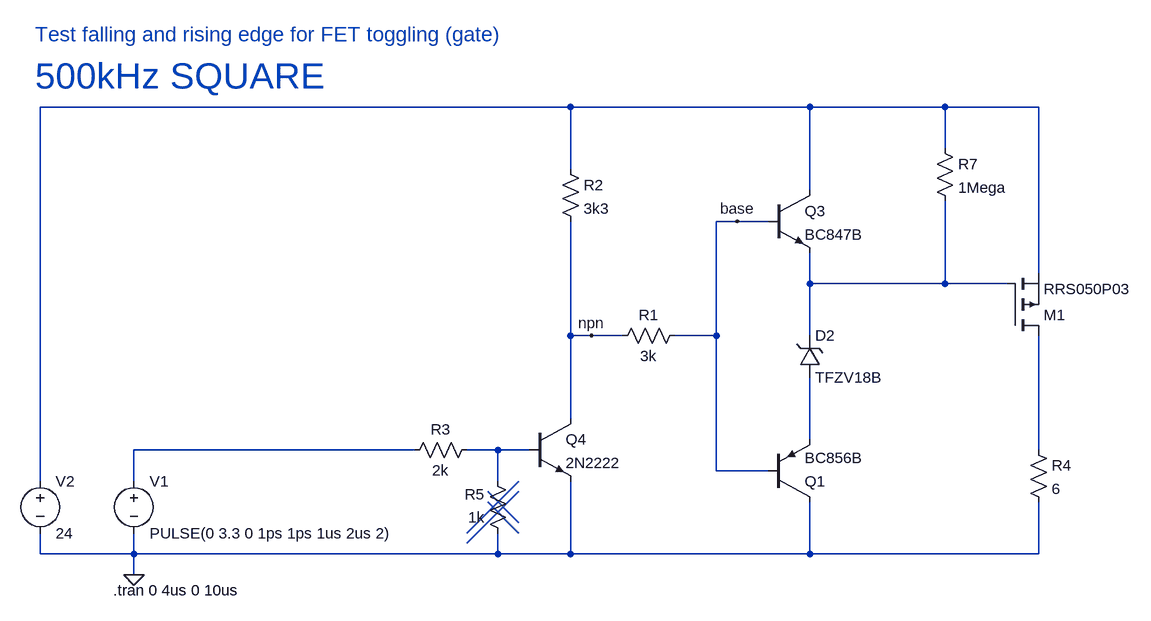
[diagram p0: schematic pwm-soldering-500kHz(original).asc]
pwm-soldering-500kHz(original).asc, the LTspice schematic file:
Version 4
SHEET 1 1716 680
WIRE 736 -576 -80 -576
WIRE 1104 -576 736 -576
WIRE 1312 -576 1104 -576
WIRE 1456 -576 1312 -576
WIRE 1312 -512 1312 -576
WIRE 736 -480 736 -576
WIRE 1104 -448 1104 -576
WIRE 992 -400 960 -400
WIRE 1040 -400 992 -400
WIRE 1456 -320 1456 -576
WIRE 1104 -304 1104 -352
WIRE 1312 -304 1312 -432
WIRE 1312 -304 1104 -304
WIRE 1408 -304 1312 -304
WIRE 736 -224 736 -400
WIRE 768 -224 736 -224
WIRE 816 -224 768 -224
WIRE 960 -224 960 -400
WIRE 960 -224 896 -224
WIRE 1104 -224 1104 -304
WIRE 736 -96 736 -224
WIRE 1104 -64 1104 -160
WIRE 496 -48 64 -48
WIRE 624 -48 576 -48
WIRE 672 -48 624 -48
WIRE 1456 -48 1456 -224
WIRE 960 -16 960 -224
WIRE 1040 -16 960 -16
WIRE -80 0 -80 -576
WIRE 64 0 64 -48
WIRE 624 0 624 -48
WIRE -80 112 -80 80
WIRE 64 112 64 80
WIRE 64 112 -80 112
WIRE 624 112 624 80
WIRE 624 112 64 112
WIRE 736 112 736 0
WIRE 736 112 624 112
WIRE 1104 112 1104 32
WIRE 1104 112 736 112
WIRE 1456 112 1456 32
WIRE 1456 112 1104 112
WIRE 64 144 64 112
FLAG 64 144 0
FLAG 768 -224 npn
FLAG 992 -400 base
SYMBOL voltage 64 -16 R0
WINDOW 123 0 0 Left 0
WINDOW 39 0 0 Left 0
SYMATTR InstName V1
SYMATTR Value PULSE(0 3.3 0 1ps 1ps 1us 2us 2)
SYMBOL pnp 1040 32 M180
SYMATTR InstName Q1
SYMATTR Value BC856B
SYMBOL npn 1040 -448 R0
SYMATTR InstName Q3
SYMATTR Value BC847B
SYMBOL pmos 1408 -224 M180
SYMATTR InstName M1
SYMATTR Value RRS050P03
SYMBOL res 720 -496 R0
SYMATTR InstName R2
SYMATTR Value 3k3
SYMBOL res 592 -64 R90
WINDOW 0 0 56 VBottom 2
WINDOW 3 32 56 VTop 2
SYMATTR InstName R3
SYMATTR Value 2k
SYMBOL voltage -80 -16 R0
WINDOW 123 0 0 Left 0
WINDOW 39 0 0 Left 0
SYMATTR InstName V2
SYMATTR Value 24
SYMBOL res 912 -240 R90
WINDOW 0 0 56 VBottom 2
WINDOW 3 32 56 VTop 2
SYMATTR InstName R1
SYMATTR Value 3k
SYMBOL res 1440 -64 R0
SYMATTR InstName R4
SYMATTR Value 6
SYMBOL res 640 96 R180
WINDOW 0 36 76 Left 2
WINDOW 3 36 40 Left 2
SYMATTR InstName R5
SYMATTR Value 1k
SYMBOL res 1296 -528 R0
SYMATTR InstName R7
SYMATTR Value 1Mega
SYMBOL npn 672 -96 R0
SYMATTR InstName Q4
SYMATTR Value 2N2222
SYMBOL zener 1088 -160 M180
WINDOW 0 24 64 Left 2
WINDOW 3 24 0 Left 2
SYMATTR InstName D2
SYMATTR Value TFZV18B
SYMATTR Description Diode
SYMATTR Type diode
TEXT 32 168 Left 2 !.tran 0 4us 0 10us
TEXT -88 -624 Left 5 ;500kHz SQUARE
TEXT -88 -688 Left 3 ;Test falling and rising edge for FET toggling (gate)
LINE Normal 576 80 656 0
LINE Normal 576 80 576 80
LINE Normal 576 80 576 80
LINE Normal 576 80 576 80
LINE Normal 576 80 576 80
LINE Normal 576 80 576 80
LINE Normal 576 80 576 80
LINE Normal 656 16 576 96
LINE Normal 656 16 656 16
LINE Normal 656 64 608 16
LINE Normal 656 64 656 64
LINE Normal 608 32 656 80
LINE Normal 608 32 608 32

The netlist it stands for:
* pwm-soldering-500kHz(original).asc
V1 N004 0 PULSE(0 3.3 0 1ps 1ps 1us 2us 2)
Q1 0 base N003 0 BC856B
Q3 N001 base N002 0 BC847B
M1 N006 N002 N001 N001 RRS050P03
R2 N001 npn 3k3
R3 N005 N004 2k
V2 N001 0 24
R1 base npn 3k
R4 N006 0 6
R5 0 N005 1k
R7 N001 N002 1Mega
Q4 npn N005 0 0 2N2222
D2 N003 N002 TFZV18B
.model D D
.lib standard.dio
.model NPN NPN
.model PNP PNP
.lib standard.bjt
.model NMOS NMOS
.model PMOS PMOS
.lib standard.mos
.tran 0 4us 0 10us
* 500kHz SQUARE
* Test falling and rising edge for FET toggling (gate)
.backanno
.end